# EasyEDA schematic Main Pannel ATMega328p_2020-08-23_19-58-32.json
TITLE: Sheet_1; REV: 1.0; Date: 2020-08-06; Sheet: 1/1; Drawn By: Saviano Luz; Company: Your Company
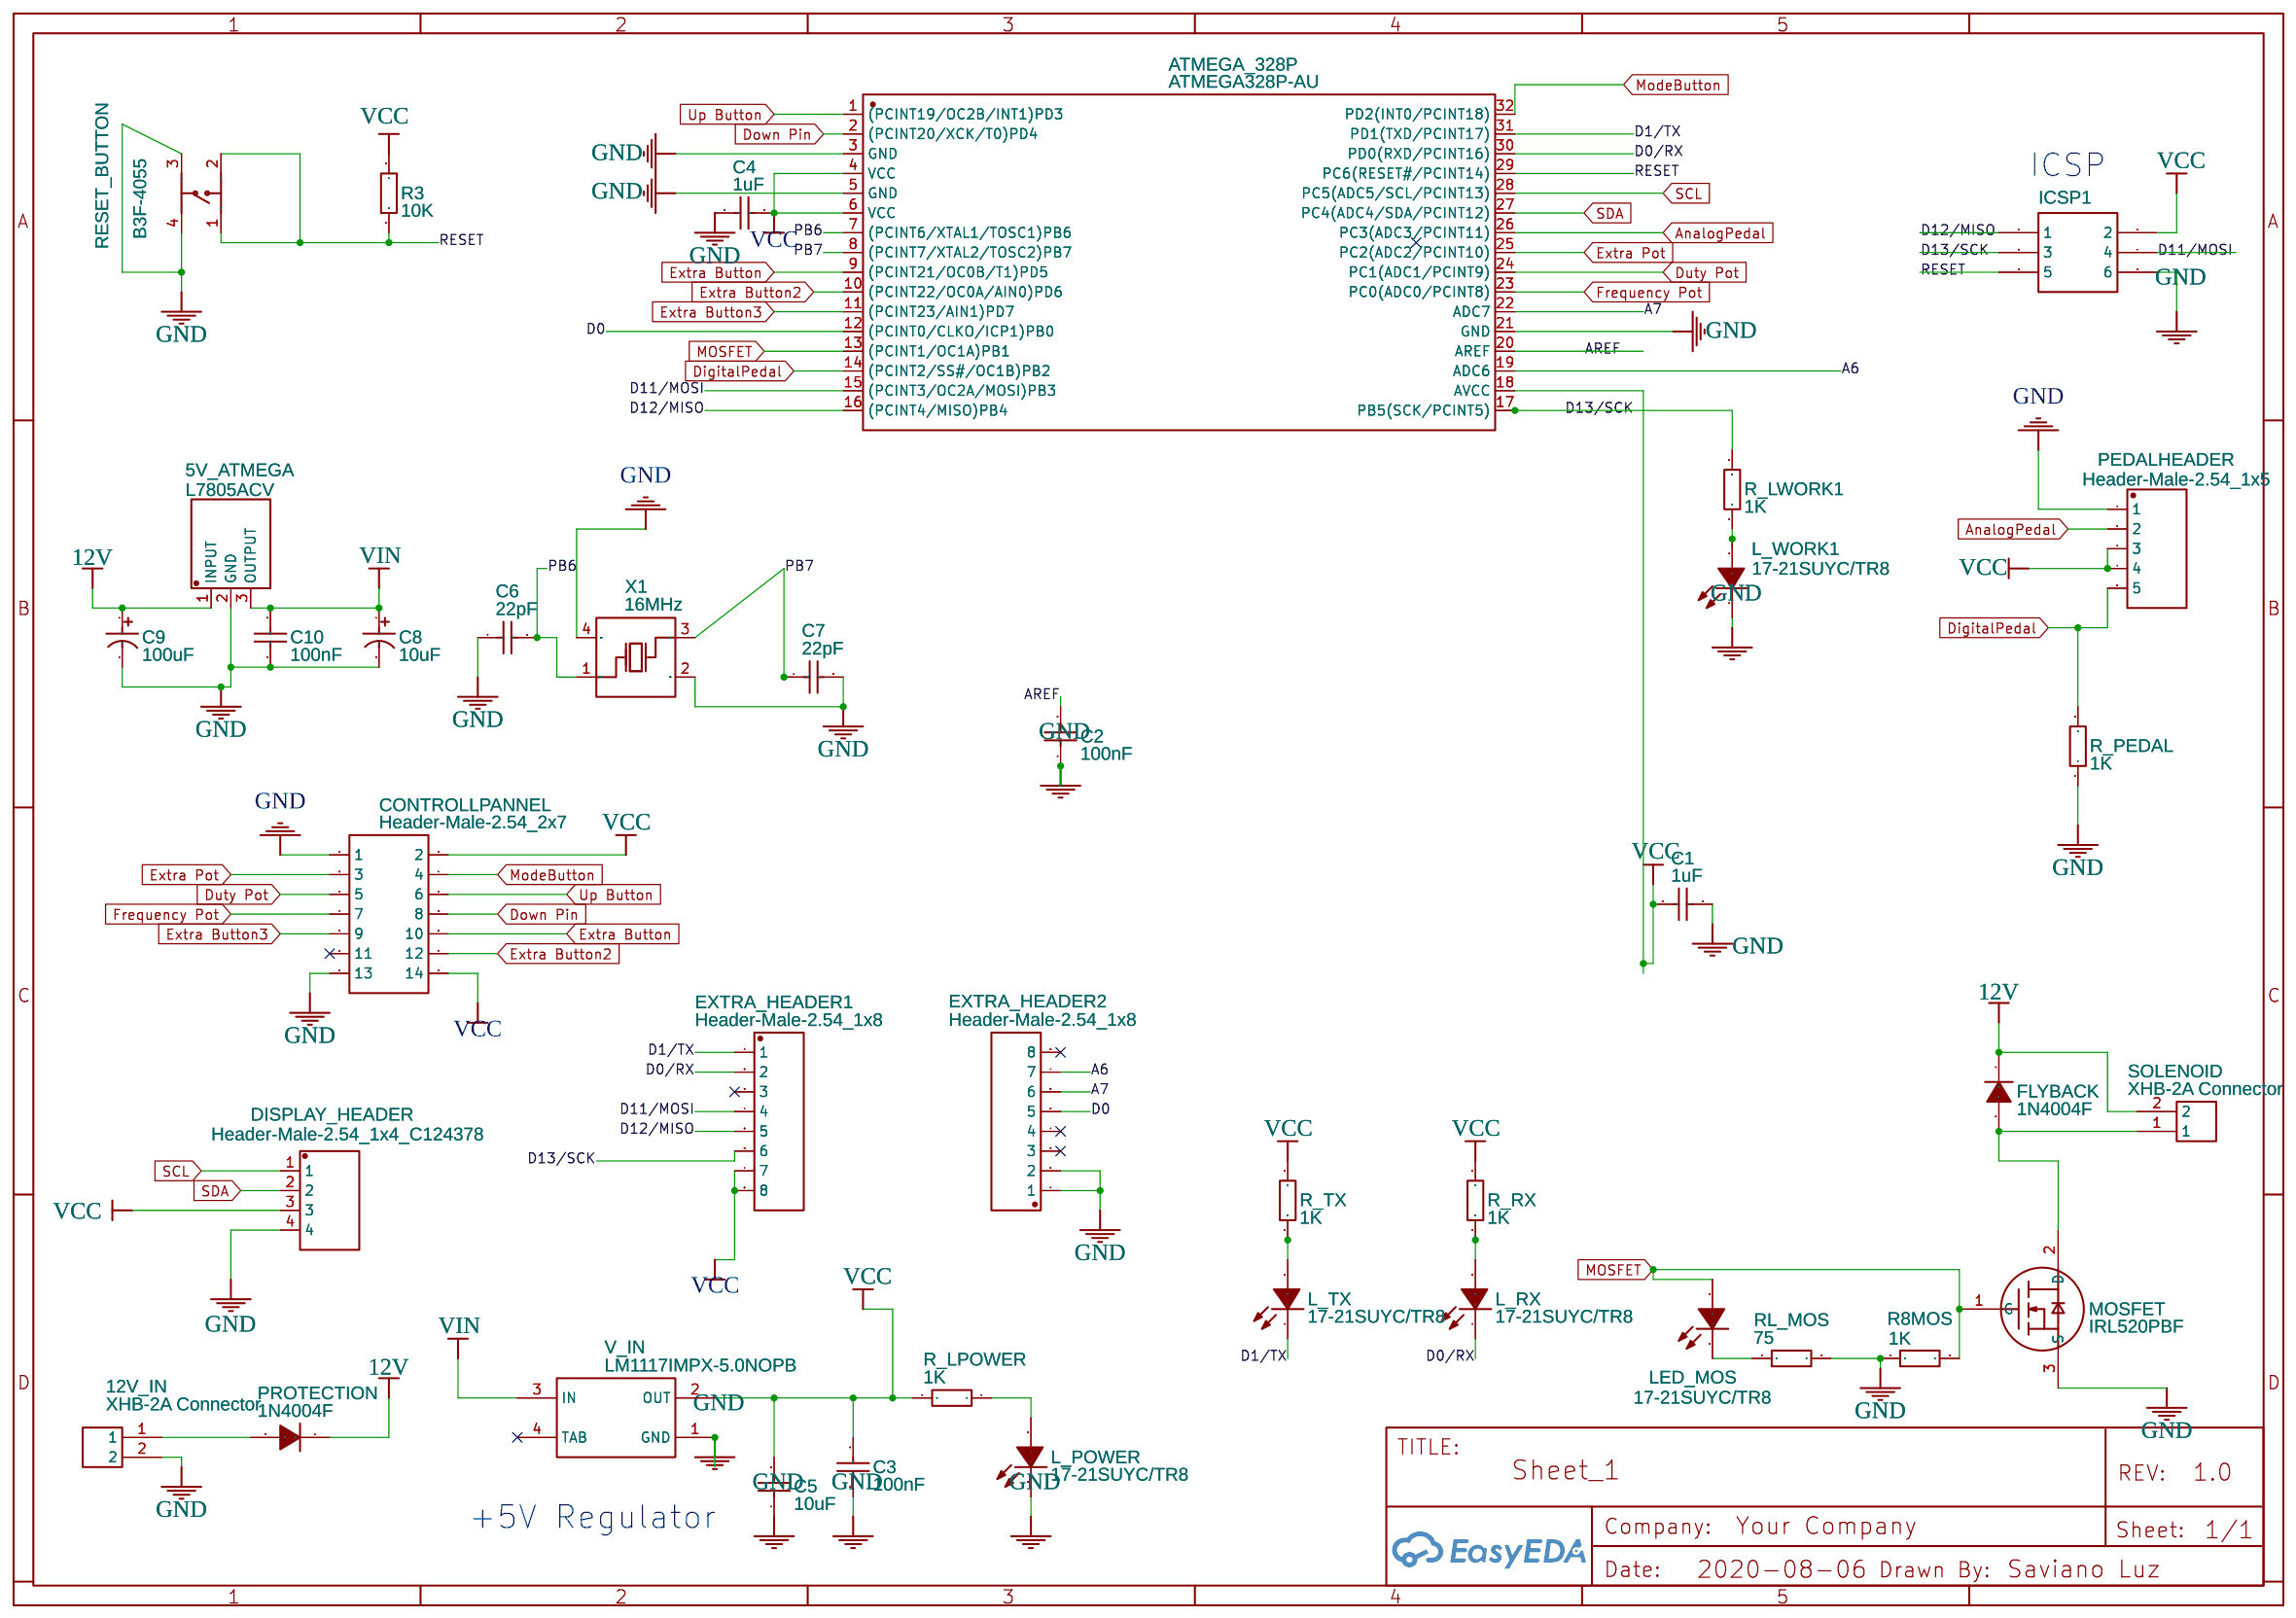
[diagram p0: schematic sheet]

## Parts
5V_ATMEGA  L7805ACV  [TO-220-3_L10.0-W4.5-P2.54-T]
12V_IN  XHB-2A Connector  [CONN-TH_XHB-2A]
ATMEGA_328P  ATMEGA328P-AU  [TQFP-32_L7.0-W7.0-P0.80-LS9.0-BL]
C1  1uF  [C0603]
C2  100nF  [C1206]
C3  100nF  [C1206]
C4  1uF  [C0603]
C5  10uF  [C1206]
C6  22pF  [C0805]
C7  22pF  [C0805]
C8  10uF  [CAP-TH_BD5.0-P2.5-D0.5-FD]
C9  100uF  [CAP-TH_BD10.0-P5.00-D1.0-FD]
C10  100nF  [C1206]
CONTROLLPANNEL  Header-Male-2.54_2x7  [HDR-TH_14P-P2.54-V-R2-C7-S2.54]
DISPLAY_HEADER  Header-Male-2.54_1x4_C124378  [HDR-TH_4P-P2.54-V]
EXTRA_HEADER1  Header-Male-2.54_1x8  [HDR-TH_8P-P2.54-V-M]
EXTRA_HEADER2  Header-Male-2.54_1x8  [HDR-TH_8P-P2.54-V-M]
FLYBACK  1N4004F  [SMAF_L3.5-W2.6-LS4.7-RD]
ICSP1  HDR2X3  [HDR2X3]
L_POWER  17-21SUYC/TR8  [LED0805-RD]
L_RX  17-21SUYC/TR8  [LED0805-RD]
L_TX  17-21SUYC/TR8  [LED0805-RD]
L_WORK1  17-21SUYC/TR8  [LED0805-RD]
LED_MOS  17-21SUYC/TR8  [LED0805-RD]
MOSFET  IRL520PBF  [ITO-220AB-3_L10.2-W4.5-P2.60-L]
PEDALHEADER  Header-Male-2.54_1x5  [HDR-TH_5P-P2.54-V]
PROTECTION  1N4004F  [SMAF_L3.5-W2.6-LS4.7-RD]
R3  10K  [R0805]
R8MOS  1K  [R1206]
R_LPOWER  1K  [R0805]
R_LWORK1  1K  [R0805]
R_PEDAL  1K  [R0805]
R_RX  1K  [R0805]
R_TX  1K  [R0805]
RESET_BUTTON  B3F-4055  [KEY-TH_4P-L12.0-W12.0-P5.00-LS13.4-EH]
RL_MOS  75  [R0805]
SOLENOID  XHB-2A Connector  [CONN-TH_XHB-2A]
V_IN  LM1117IMPX-5.0NOPB  [SOT-223]
X1  16MHz  [OSC-SMD_4P-L3.2-W2.5-BL]

## Library data of the parts
5V_ATMEGA = L7805ACV: Supplier: LCSC; Supplier Part: C192854; Manufacturer: STMicroelectronics; Contributor: LCSC
12V_IN SOLENOID = XHB-2A Connector: Supplier: LCSC; Manufacturer: BOOMELE; image: //image.lceda.cn/szlcsc/C57981.jpg; Supplier Part: C57981
ATMEGA_328P = ATMEGA328P-AU: Supplier: LCSC; Manufacturer: MICROCHIP; image: //image.lceda.cn/szlcsc/C14877.jpg; Supplier Part: C14877; LCSC Assembly: Yes; SMT Type: Basic
C1 C4 = CL10A105KB8NNNC: Supplier: LCSC; Manufacturer: SAMSUNG; LCSC Assembly: Yes; Supplier Part: C15849; SMT Type: Basic
C2 C3 C10 = CL31B104KBCNNNC: Supplier: LCSC; Manufacturer: SAMSUNG; LCSC Assembly: Yes; Supplier Part: C24497; SMT Type: Basic
C5 = CL31A106KBHNNNE: Supplier: LCSC; Manufacturer: SAMSUNG; LCSC Assembly: Yes; Supplier Part: C13585; SMT Type: Basic
C6 C7 = CL21C220JBANNNC: Supplier: LCSC; Manufacturer: SAMSUNG; LCSC Assembly: Yes; Supplier Part: C1804; SMT Type: Basic
C8 = C10uF63V2.5mm5x11mm: Supplier: LCSC; Manufacturer: ReliaPro; Supplier Part: C32455
C9 = 10X17 100V100uf: Supplier: LCSC; Manufacturer: ValuePro; Supplier Part: C3336
CONTROLLPANNEL = Header-Male-2.54_2x7: Supplier: LCSC; Manufacturer: BOOMELE; Manufacturer Part: Double row of needle2X7P 2.54mm; Supplier Part: C71397
DISPLAY_HEADER = Header-Male-2.54_1x4_C124378: Supplier: LCSC; Manufacturer: Ckmtw; Manufacturer Part: 210S-1*4P L=11.6MMGold-plated black; Contributor: LCSC; Supplier Part: C124378
EXTRA_HEADER1 EXTRA_HEADER2 = Header-Male-2.54_1x8: Supplier: LCSC; Manufacturer: Ckmtw; Manufacturer Part: 210S-1*8P L=11.6MMGold-plated black; Contributor: LCSC; Supplier Part: C124381
FLYBACK PROTECTION = 1N4004F: Supplier: LCSC; Manufacturer: SK; Supplier Part: C122842; LCSC Assembly: Yes; SMT Type: Extend
ICSP1 = -: catid: 20; Manufacturer Part: ?
L_POWER L_RX L_TX L_WORK1 LED_MOS = 17-21SUYC/TR8: Supplier: LCSC; Manufacturer: KENTO; LCSC Assembly: Yes; image: //image.lceda.cn/szlcsc/C2296.jpg; Supplier Part: C2296; SMT Type: Basic
MOSFET = IRL520PBF: Supplier: LCSC; Manufacturer: VISHAY; Contributor: LCSC; Supplier Part: C145199
PEDALHEADER = Header-Male-2.54_1x5: Supplier: LCSC; Manufacturer: Ckmtw; Manufacturer Part: 210S-1*5P L=11.6MMGold-plated black; Contributor: LCSC; Supplier Part: C124379
R3 = 0805W8F1002T5E: Supplier: LCSC; Manufacturer: UniOhm; LCSC Assembly: Yes; Supplier Part: C17414; SMT Type: Basic
R8MOS = 1206W4F1001T5E: Supplier: LCSC; Manufacturer: UniOhm; LCSC Assembly: Yes; Supplier Part: C4410; SMT Type: Basic
R_LPOWER R_LWORK1 R_PEDAL R_RX R_TX = 0805W8F1001T5E: Supplier: LCSC; Manufacturer: UniOhm; LCSC Assembly: Yes; Supplier Part: C17513; SMT Type: Basic
RESET_BUTTON = B3F-4055: Supplier: LCSC; Manufacturer: OMRON; Supplier Part: C84931
RL_MOS = 0805W8F750JT5E: Supplier: LCSC; Manufacturer: UniOhm; LCSC Assembly: Yes; Supplier Part: C20638; SMT Type: Basic
V_IN = -: 800mA Low-Dropout Linear Regulator, 4-pin SOT-223, Pb-Free; catid: 20; Manufacturer Part: ?; Supplier: LCSC; Supplier Part: C41202
X1 = X322516MLB4SI: Supplier: LCSC; Manufacturer: YXC; LCSC Assembly: Yes; Supplier Part: C13738; SMT Type: Basic

## Nets
12V: 5V_ATMEGA.1(INPUT) C9.1 FLYBACK.1(C) PROTECTION.1(C) SOLENOID.2
GND: 5V_ATMEGA.2(GND) 12V_IN.2 ATMEGA_328P.3(GND) ATMEGA_328P.5(GND) ATMEGA_328P.21(GND) C1.2 C2.1 C3.1 C4.1 C5.1 C6.1 C7.2 C8.2 C9.2 C10.1 CONTROLLPANNEL.1 CONTROLLPANNEL.13 DISPLAY_HEADER.4 EXTRA_HEADER2.1 EXTRA_HEADER2.2 ICSP1.6 L_POWER.1(-) L_WORK1.1(-) MOSFET.3(S) PEDALHEADER.1 R8MOS.1 R_PEDAL.1 RESET_BUTTON.3 RESET_BUTTON.4 RL_MOS.2 V_IN.1(GND) X1.2(GND) X1.4(GND)
VCC: ATMEGA_328P.4(VCC) ATMEGA_328P.6(VCC) ATMEGA_328P.18(AVCC) C1.1 C3.2 C4.2 C5.2 CONTROLLPANNEL.2 CONTROLLPANNEL.14 DISPLAY_HEADER.3 EXTRA_HEADER1.7 EXTRA_HEADER1.8 ICSP1.2 PEDALHEADER.3 PEDALHEADER.4 R3.2 R_LPOWER.2 R_RX.2 R_TX.2 V_IN.2(OUT)
VIN: 5V_ATMEGA.3(OUTPUT) C8.1 C10.2 V_IN.3(IN)
A6: ATMEGA_328P.19(ADC6) EXTRA_HEADER2.7
A7: ATMEGA_328P.22(ADC7) EXTRA_HEADER2.6
AnalogPedal: ATMEGA_328P.26(PC3(ADC3/PCINT11)) PEDALHEADER.2
AREF: ATMEGA_328P.20(AREF) C2.2
D0: ATMEGA_328P.12((PCINT0/CLKO/ICP1)PB0) EXTRA_HEADER2.5
D0/RX: ATMEGA_328P.30(PD0(RXD/PCINT16)) EXTRA_HEADER1.2 L_RX.1(-)
D1/TX: ATMEGA_328P.31(PD1(TXD/PCINT17)) EXTRA_HEADER1.1 L_TX.1(-)
D11/MOSI: ATMEGA_328P.15((PCINT3/OC2A/MOSI)PB3) EXTRA_HEADER1.4 ICSP1.4
D12/MISO: ATMEGA_328P.16((PCINT4/MISO)PB4) EXTRA_HEADER1.5 ICSP1.1
D13/SCK: ATMEGA_328P.17(PB5(SCK/PCINT5)) EXTRA_HEADER1.6 ICSP1.3 R_LWORK1.2
DigitalPedal: ATMEGA_328P.14((PCINT2/SS#/OC1B)PB2) PEDALHEADER.5 R_PEDAL.2
Down Pin: ATMEGA_328P.2((PCINT20/XCK/T0)PD4) CONTROLLPANNEL.8
Duty Pot: ATMEGA_328P.24(PC1(ADC1/PCINT9)) CONTROLLPANNEL.5
Extra Button: ATMEGA_328P.9((PCINT21/OC0B/T1)PD5) CONTROLLPANNEL.10
Extra Button2: ATMEGA_328P.10((PCINT22/OC0A/AIN0)PD6) CONTROLLPANNEL.12
Extra Button3: ATMEGA_328P.11((PCINT23/AIN1)PD7) CONTROLLPANNEL.9
Extra Pot: ATMEGA_328P.25(PC2(ADC2/PCINT10)) CONTROLLPANNEL.3
Frequency Pot: ATMEGA_328P.23(PC0(ADC0/PCINT8)) CONTROLLPANNEL.7
ModeButton: ATMEGA_328P.32(PD2(INT0/PCINT18)) CONTROLLPANNEL.4
MOSFET: ATMEGA_328P.13((PCINT1/OC1A)PB1) LED_MOS.2(+) MOSFET.1(G) R8MOS.2
PB6: ATMEGA_328P.7((PCINT6/XTAL1/TOSC1)PB6) C6.2 X1.1(OSC1)
PB7: ATMEGA_328P.8((PCINT7/XTAL2/TOSC2)PB7) C7.1 X1.3(OSC2)
RESET: ATMEGA_328P.29(PC6(RESET#/PCINT14)) ICSP1.5 R3.1 RESET_BUTTON.1 RESET_BUTTON.2
SCL: ATMEGA_328P.28(PC5(ADC5/SCL/PCINT13)) DISPLAY_HEADER.1
SDA: ATMEGA_328P.27(PC4(ADC4/SDA/PCINT12)) DISPLAY_HEADER.2
Up Button: ATMEGA_328P.1((PCINT19/OC2B/INT1)PD3) CONTROLLPANNEL.6
Net-(12V_IN-1): 12V_IN.1 PROTECTION.2(A)
Net-(FLYBACK-2): FLYBACK.2(A) MOSFET.2(D) SOLENOID.1
Net-(L_POWER-2): L_POWER.2(+) R_LPOWER.1
Net-(L_RX-2): L_RX.2(+) R_RX.1
Net-(L_TX-2): L_TX.2(+) R_TX.1
Net-(L_WORK1-2): L_WORK1.2(+) R_LWORK1.1
Net-(LED_MOS-1): LED_MOS.1(-) RL_MOS.1

Not connected (* = marked no-connect by the designer): CONTROLLPANNEL 11*; EXTRA_HEADER1 3*; EXTRA_HEADER2 3* 4* 8*; V_IN 4(TAB)*

## Notes on the sheet
- ICSP
- +5V Regulator
